# EAGLE schematic Arduino Nano SD Serayu 2024 (EAGLE 9.6.2)
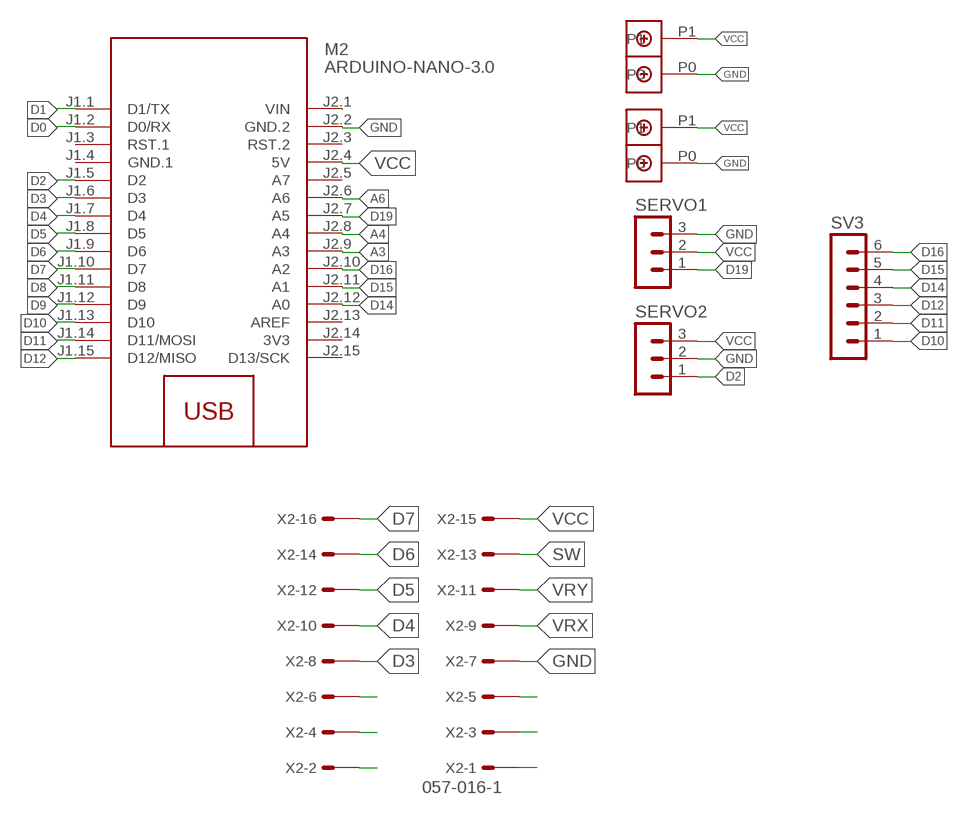
[diagram p0: schematic, sheet 1]

## Parts
M2  ARDUINO-NANO-3.0  [ARDUINO-NANO-3.0]
SERVO1  MA03-1  [MA03-1]
SERVO2  MA03-1  [MA03-1]
SV3  MA06-1  [MA06-1]
U$1  DBCONN-1X2  [DBCONN-1X2]
U$2  DBCONN-1X2  [DBCONN-1X2]
X2  057-016-1  [057-016-1]

## Nets
A3: M2.J2.9(A3)
A4: M2.J2.8(A4)
A6: M2.J2.6(A6)
D0: M2.J1.2(D0/RX)
D1: M2.J1.1(D1/TX)
D2: M2.J1.5(D2) SERVO2.1
D3: M2.J1.6(D3) X2.8
D4: M2.J1.7(D4) X2.10
D5: M2.J1.8(D5) X2.12
D6: M2.J1.9(D6) X2.14
D7: M2.J1.10(D7) X2.16
D8: M2.J1.11(D8)
D9: M2.J1.12(D9)
D10: M2.J1.13(D10) SV3.1
D11: M2.J1.14(D11/MOSI) SV3.2
D12: M2.J1.15(D12/MISO) SV3.3
D14: M2.J2.12(A0) SV3.4
D15: M2.J2.11(A1) SV3.5
D16: M2.J2.10(A2) SV3.6
D19: M2.J2.7(A5) SERVO1.1
GND: M2.J2.2(GND.2) SERVO1.3 SERVO2.2 U$1.P0 U$2.P0 X2.7
N$6: X2.6
N$7: X2.4
N$8: X2.2
N$14: X2.5
N$15: X2.3
N$16: X2.1
SW: X2.13
VCC: M2.J2.1(VIN) M2.J2.4(5V) SERVO1.2 SERVO2.3 U$1.P1 U$2.P1 X2.15
VRX: X2.9
VRY: X2.11
Unconnected: M2.J1.3(RST.1) M2.J2.3(RST.2) M2.J2.5(A7) M2.J2.13(AREF) M2.J2.15(D13/SCK)

## Power pins joined to a net without a drawn wire
3V3: M2.J2.14(3V3)
GND.1: M2.J1.4(GND.1)

## Library data of the parts
M2 = diy-modules:ARDUINO-NANO-3.0: Arduino Nano 3.0 and compatible devices More details available here: https://www.arduino.cc/en/Main/ArduinoBoardNano Click here to find device on ebay.com <http://www.ebay.com/sch/arduino+nano>
SERVO1 SERVO2 = con-lstb:MA03-1: PIN HEADER; OC_FARNELL: unknown; OC_NEWARK: unknown
SV3 = con-lstb:MA06-1: PIN HEADER; OC_FARNELL: unknown; OC_NEWARK: unknown
U$1 U$2 = Terminal Block Connector:DBCONN-1X2
X2 = con-panduit:057-016-: CONNECTOR 10-pin series 057 contact pc board low profile headers; OC_FARNELL: unknown; OC_NEWARK: unknown